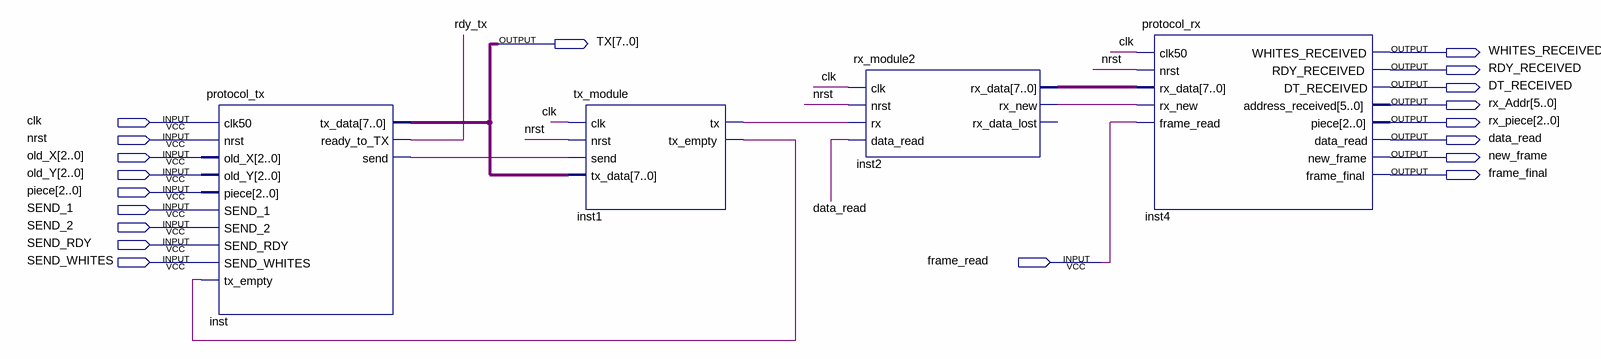
[diagram p0: schematic sheet]
// Quartus schematic bloc_tx_rx.bdf as structural Verilog: 4 symbols, 19 pins
module bloc_tx_rx (
  input  clk,
  input  nrst,
  input  [2:0] old_X,
  input  [2:0] old_Y,
  input  [2:0] piece,
  input  SEND_1,
  input  SEND_2,
  input  SEND_RDY,
  input  SEND_WHITES,
  input  frame_read,
  output [7:0] TX,
  output WHITES_RECEIVED,
  output RDY_RECEIVED,
  output DT_RECEIVED,
  output [5:0] rx_Addr,
  output [2:0] rx_piece,
  output data_read,
  output new_frame,
  output frame_final
);

  wire inst1_tx, inst1_tx_empty, inst2_rx_new, inst_send, rdy_tx;
  wire [7:0] inst2_rx_data;

  protocol_tx inst (
    .clk50(clk), .nrst(nrst), .old_X(old_X), .old_Y(old_Y), .piece(piece), .SEND_1(SEND_1), .SEND_2(SEND_2),
    .SEND_RDY(SEND_RDY), .SEND_WHITES(SEND_WHITES), .tx_empty(inst1_tx_empty), .tx_data(TX),
    .ready_to_TX(rdy_tx), .send(inst_send));
  tx_module inst1 (.clk(clk), .nrst(nrst), .send(inst_send), .tx_data(TX), .tx(inst1_tx), .tx_empty(inst1_tx_empty));
  rx_module2 inst2 (
    .clk(clk), .nrst(nrst), .rx(inst1_tx), .data_read(data_read), .rx_data(inst2_rx_data),
    .rx_new(inst2_rx_new));  // open: rx_data_lost
  protocol_rx inst4 (
    .clk50(clk), .nrst(nrst), .rx_data(inst2_rx_data), .rx_new(inst2_rx_new), .frame_read(frame_read),
    .WHITES_RECEIVED(WHITES_RECEIVED), .RDY_RECEIVED(RDY_RECEIVED), .DT_RECEIVED(DT_RECEIVED),
    .address_received(rx_Addr), .piece(rx_piece), .data_read(data_read), .new_frame(new_frame),
    .frame_final(frame_final));
endmodule
